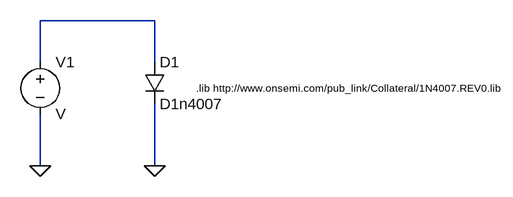
[diagram p0: schematic Third partydrafts.asc]
Third partydrafts.asc, the LTspice schematic file:
Version 4
SHEET 1 880 680
WIRE 304 -16 128 -16
WIRE 128 48 128 -16
WIRE 304 48 304 -16
WIRE 128 208 128 128
WIRE 304 208 304 112
FLAG 128 208 0
FLAG 304 208 0
SYMBOL voltage 128 32 R0
SYMATTR InstName V1
SYMBOL diode 288 48 R0
SYMATTR InstName D1
SYMATTR Value D1n4007
TEXT 368 88 Left 1 !.lib http://www.onsemi.com/pub_link/Collateral/1N4007.REV0.lib

The netlist it stands for:
* Third partydrafts.asc
V1 N001 0 V
D1 N001 0 D1n4007
.model D D
.lib standard.dio
.lib http://www.onsemi.com/pub_link/Collateral/1N4007.REV0.lib
.backanno
.end